# Altium schematic sheet Sheet1.SchDoc
size 449 x 400 mm; SheetNumber: 1; SheetTotal: 1
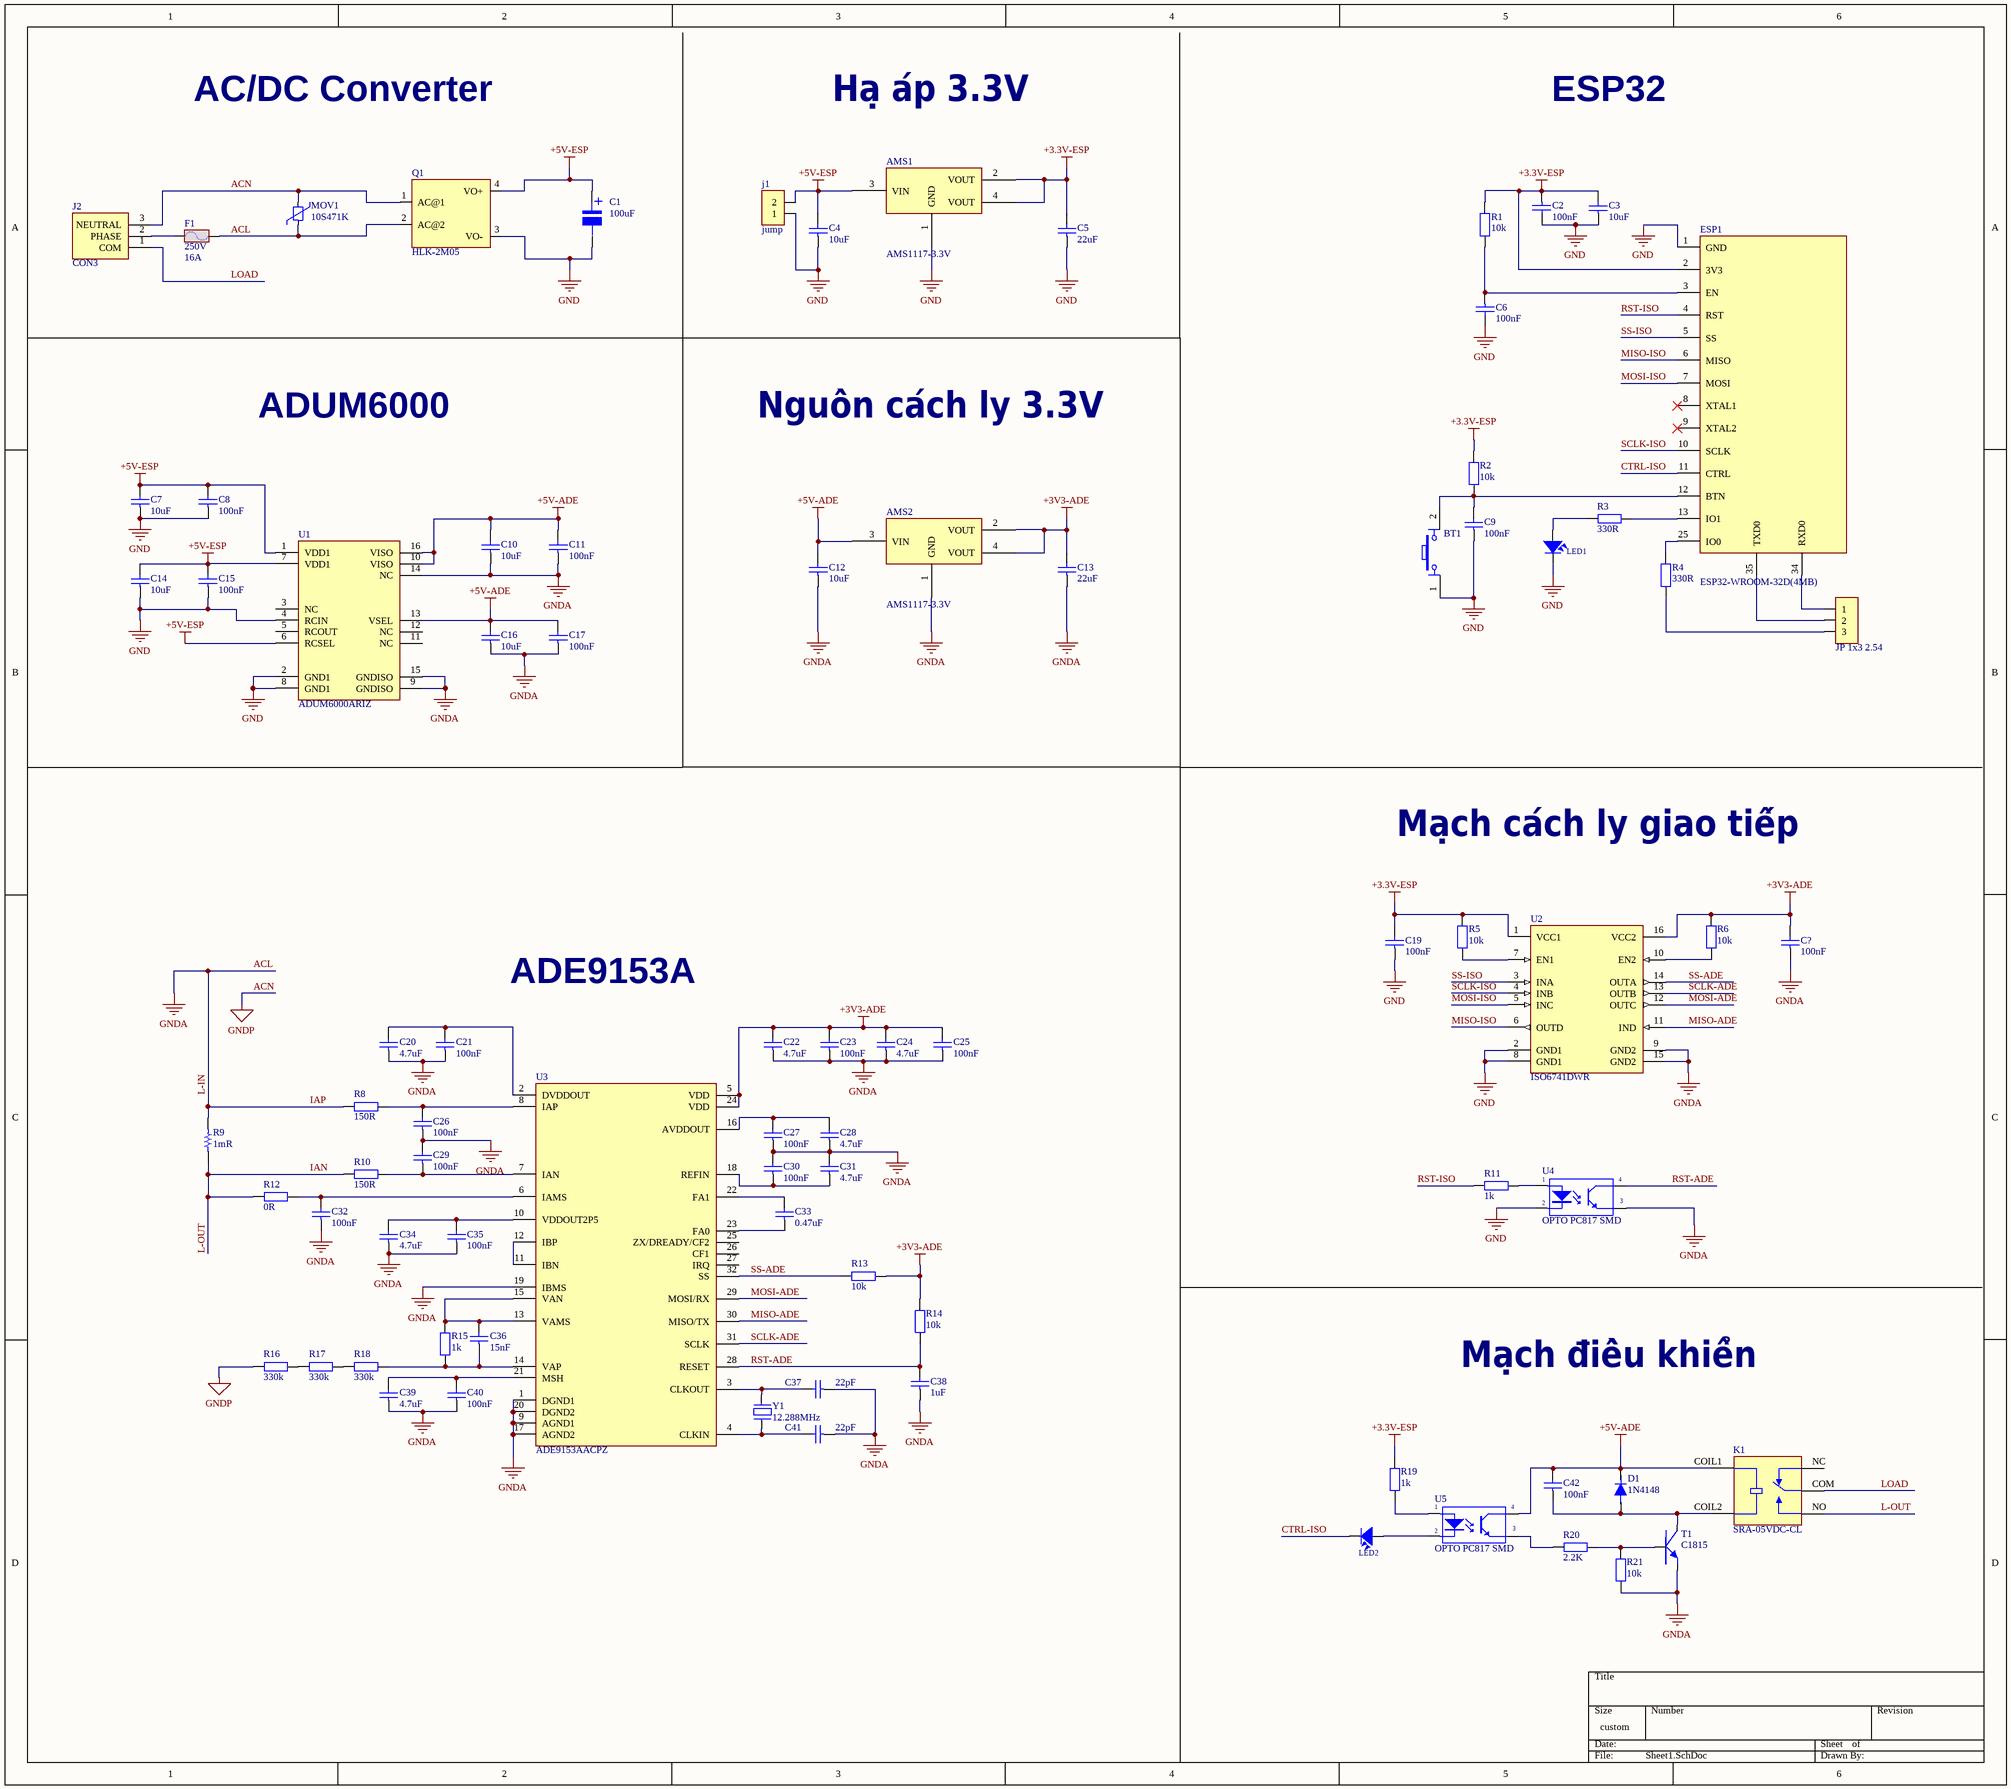
[diagram p0: Sheet1.SchDoc]

## Parts
AMS1  AMS1117-3.3V  [SOT223]
AMS2  AMS1117-3.3V  [SOT223]
BT1  Nut Nhan 4 Chan Cam 6x6  [Nut Nhan 4 Chan Cam 6x6]  (value not drawn)
C1  100uF  [tu nhom 6.3 (d)]
C2  100nF  [C0603C/1608MM]
C3  10uF  [C0603C/1608MM]
C4  10uF  [C0603C/1608MM]
C5  22uF  [C0603C/1608MM]
C6  100nF  [C0603C/1608MM]
C7  10uF  [C0603C/1608MM]
C8  100nF  [C0603C/1608MM]
C9  100nF  [C0603C/1608MM]
C10  10uF  [C0603C/1608MM]
C11  100nF  [C0603C/1608MM]
C12  10uF  [C0603C/1608MM]
C13  22uF  [C0603C/1608MM]
C14  10uF  [C0603C/1608MM]
C15  100nF  [C0603C/1608MM]
C16  10uF  [C0603C/1608MM]
C17  100nF  [C0603C/1608MM]
C19  100nF  [C0603C/1608MM]
C20  4.7uF  [C0603C/1608MM]
C21  100nF  [C0603C/1608MM]
C22  4.7uF  [C0603C/1608MM]
C23  100nF  [C0603C/1608MM]
C24  4.7uF  [C0603C/1608MM]
C25  100nF  [C0603C/1608MM]
C26  100nF  [C0603C/1608MM]
C27  100nF  [C0603C/1608MM]
C28  4.7uF  [C0603C/1608MM]
C29  100nF  [C0603C/1608MM]
C30  100nF  [C0603C/1608MM]
C31  4.7uF  [C0603C/1608MM]
C32  100nF  [C0603C/1608MM]
C33  0.47uF  [C0603C/1608MM]
C34  4.7uF  [C0603C/1608MM]
C35  100nF  [C0603C/1608MM]
C36  15nF  [C0603C/1608MM]
C37  22pF  [C0603C/1608MM]
C38  1uF  [C0603C/1608MM]
C39  4.7uF  [C0603C/1608MM]
C40  100nF  [C0603C/1608MM]
C41  22pF  [C0603C/1608MM]
C42  100nF  [C0603C/1608MM]
C?  100nF  [C0603C/1608MM]
D1  1N4148  [SOD-323]
ESP1  ESP32-WROOM-32D(4MB)  [ESP32]
F1  Voltage - Rated: 250V  Current Rating (Amps): 16A  [FUSE_VERTICAL]  (hidden comment: 5A220V)
j1  jump  [Jump 2]
J2  CON3  [CON3]
JP1  JP 1x3 2.54  [JP 1x3 DT]
K1  SRA-05VDC-CL  [RELAY_SRA-05VDC-CL]
LED1  LED SMD  [SM-LED-0805-Blue]  (value not drawn)
LED2  LED SMD  [SM-LED-0805-Blue]  (value not drawn)
MOV1  10S471K  [10S471K]
Q1  HLK-2M05  [HLK-2M05]
R1  10k  [tro smd 0603]
R2  10k  [tro smd 0603]
R3  330R  [tro smd 0603]
R4  330R  [tro smd 0603]
R5  10k  [tro smd 0603]
R6  10k  [tro smd 0603]
R8  150R  [tro smd 0603]
R9  1mR  [R2512B/6332MM]
R10  150R  [tro smd 0603]
R11  1k  [tro smd 0603]
R12  0R  [tro smd 0603]
R13  10k  [tro smd 0603]
R14  10k  [tro smd 0603]
R15  1k  [tro smd 0603]
R16  330k  [tro smd 0603]
R17  330k  [tro smd 0603]
R18  330k  [tro smd 0603]
R19  1k  [tro smd 0603]
R20  2.2K  [tro smd 0603]
R21  10k  [tro smd 0603]
T1  C1815  [C1815]
U1  ADUM6000ARIZ  [ADUM6000ARIZ]
U2  ISO6741DWR  [SOIC127P1030X265-16N]
U3  ADE9153AACPZ  [ADE9153]
U4  OPTO PC817 SMD  [SOP4]
U5  OPTO PC817 SMD  [SOP4]
Y1  12.288MHz  [Thach Anh 2 chan cam]

## Nets
+3.3V-ESP: AMS1.2(VOUT) AMS1.4(VOUT) C2.1 C3.2 C5.2 C19.2 ESP1.2(3V3) R1.2 R2.2 R5.2 R19.2 U2.1(VCC1)
+3V3-ADE: AMS2.2(VOUT) AMS2.4(VOUT) C13.2 C22.2 C23.2 C24.2 C25.2 C?.2 R6.2 R13.2 R14.2 U2.16(VCC2) U3.5(VDD) U3.24(VDD)
+5V-ADE: AMS2.3(VIN) C10.2 C11.2 C12.2 C16.2 C17.2 C42.2 D1.2(CATHODE) K1.COIL1 U1.10(VISO) U1.13(VSEL) U1.16(VISO) U5.4(C)
+5V-ESP: AMS1.3(VIN) C1.1 C4.2 C7.2 C8.2 C14.2 C15.2 j1.2 Q1.4(VO+) U1.1(VDD1) U1.6(RCSEL) U1.7(VDD1)
ACL: AMS2.1(GND) C10.1 C11.1 C12.1 C13.1 C16.1 C17.1 C20.1 C21.1 C22.1 C23.1 C24.1 C25.1 C26.1 C27.1 C28.1 C29.2 C30.2 C31.2 C32.1 C34.1 C35.1 C37.1 C38.1 C39.1 C40.1 C41.1 C?.1 F1.1 MOV1.2 Q1.2(AC@2) R8.1 R9.2 R21.1 T1.2 U1.9(GNDISO) U1.14(NC) U1.15(GNDISO) U2.9(GND2) U2.15(GND2) U3.1(DGND1) U3.9(AGND1) U3.17(AGND2) U3.19(IBMS) U3.20(DGND2) U4.3(E)  [also labelled GNDA, IAP, L-IN]
ACN: J2.3(NEUTRAL) MOV1.1 Q1.1(AC@1) R16.1  [also labelled GNDP]
GND: AMS1.1(GND) BT1.1 C1.2 C2.2 C3.1 C4.1 C5.1 C6.2 C7.1 C8.1 C9.1 C14.1 C15.1 C19.1 ESP1.1(GND) j1.1 LED1.2 Q1.3(VO-) U1.2(GND1) U1.4(RCIN) U1.8(GND1) U2.2(GND1) U2.8(GND1) U4.2(K)
CTRL-ISO: ESP1.11(CTRL) LED2.2
IAN: K1.NO R9.1 R10.1 R12.1  [also labelled L-OUT]
LOAD: J2.1(COM) K1.COM
MISO-ADE: U2.11(IND) U3.30(MISO/TX)
MISO-ISO: ESP1.6(MISO) U2.6(OUTD)
MOSI-ADE: U2.12(OUTC) U3.29(MOSI/RX)
MOSI-ISO: ESP1.7(MOSI) U2.5(INC)
RST-ADE: C38.2 R14.1 U3.28(RESET) U4.4(C)
RST-ISO: ESP1.4(RST) R11.1
SCLK-ADE: U2.13(OUTB) U3.31(SCLK)
SCLK-ISO: ESP1.10(SCLK) U2.4(INB)
SS-ADE: R13.1 U2.14(OUTA) U3.32(SS)
SS-ISO: ESP1.5(SS) U2.3(INA)
NetBT1_2: BT1.2 C9.2 ESP1.12(BTN) R2.1
NetC6_1: C6.1 ESP1.3(EN) R1.1
NetC20_2: C20.2 C21.2 U3.2(DVDDOUT)
NetC26_2: C26.2 R8.2 U3.8(IAP)
NetC27_2: C27.2 C28.2 U3.16(AVDDOUT)
NetC29_1: C29.1 R10.2 U3.7(IAN)
NetC30_1: C30.1 C31.1 U3.18(REFIN)
NetC32_2: C32.2 R12.2 U3.6(IAMS)
NetC33_1: C33.1 U3.23(FA0)
NetC33_2: C33.2 U3.22(FA1)
NetC34_2: C34.2 C35.2 U3.10(VDDOUT2P5)
NetC36_1: C36.1 R15.1 R18.2 U3.14(VAP)
NetC36_2: C36.2 R15.2 U3.13(VAMS) U3.15(VAN)
NetC37_2: C37.2 U3.3(CLKOUT) Y1.2
NetC39_2: C39.2 C40.2 U3.21(MSH)
NetC41_2: C41.2 U3.4(CLKIN) Y1.1
NetC42_1: C42.1 D1.1(ANODE) K1.COIL2 T1.3
NetESP1_13: ESP1.13(IO1) R3.1
NetESP1_25: ESP1.25(IO0) R4.1
NetESP1_34: ESP1.34(RXD0) JP1.1
NetESP1_35: ESP1.35(TXD0) JP1.2
NetF1_2: F1.2 J2.2(PHASE)
NetJP1_3: JP1.3 R4.2
NetLED1_1: LED1.1 R3.2
NetLED2_1: LED2.1 U5.2(K)
NetR5_1: R5.1 U2.7(EN1)
NetR6_1: R6.1 U2.10(EN2)
NetR11_2: R11.2 U4.1(A)
NetR16_2: R16.2 R17.1
NetR17_2: R17.2 R18.1
NetR19_1: R19.1 U5.1(A)
NetR20_1: R20.1 R21.2 T1.1
NetR20_2: R20.2 U5.3(E)
NetU3_11: U3.11(IBN) U3.12(IBP)

Not connected (* = marked no-connect by the designer): ESP1 8(XTAL1)* 9(XTAL2)*; K1 NC; U1 3(NC) 5(RCOUT) 11(NC) 12(NC); U3 25(ZX/DREADY/CF2) 26(CF1) 27(IRQ)

## Notes on the sheet
- AC/DC Converter
- Hạ áp 3.3V
- ESP32
- ADUM6000
- Nguồn cách ly 3.3V
- Mạch cách ly giao tiếp
- ADE9153A
- Mạch điều khiển
- (in symbol Tu Nhom 100uF 16V) +

## Library data of the parts
AMS1 AMS2 = AMS1117 SMD: Dán; Value: AMS1117-3.3V SOT223; Don_Vi: Con; Ma_Hang: MH000596; Ghi_Chu: *; Kieu_Chan: *; Chung_Loai: Dán
BT1 = Nut Nhan 4 Chan Cam 6x6: Nut Nhan 4 Chan 6x6mm; Ten: Nút Nhấn 4 Chân 6x6x5MM DIP; Ma_Hang: MH004584
C1 = Tu Nhom 100uF 16V: Dán; Don_Vi: Con; So_Chan: 2; Ten_Linh_Kien: Tụ Nhôm 100uF 16V 6.3x5.4MM; Ma_Hang: MH002219; Chung_Loai: Dán; Kieu_Chan: *
C2 C6 C8 C9 C11 C15 C17 C19 C21 C23 C25-C27 C29 C30 C32 C35 C40 C42 C? = CAP CER 100nF 16V 5% X7R 0603: Cap Ceramic 0.1uF 16V X7R 5% SMD 0603 125C T/R; Manufacturer: Yageo; Manufacturer Part Number: CC0603JRX7R7BB104; Supplier 1: Digi-Key; Stock 1: 333951; Pricing 1: 1=0.1, 10=0.077, 50=0.042, 100=0.0343, 500=0.02448, 1000=0.01923 (USD); Mount: Surface Mount; Case/Package: 0603; Number of Pins: 2; Case Code (Metric): 1608; Case Code (Imperial): 0603; Min Operating Temperature: -55°C; Max Operating Temperature: 125°C; Capacitance: 100nF; Tolerance: 5%; Voltage Rating: 16V; Packaging: Tape and Reel; Dielectric: X7R; Voltage Rating (DC): 16V; Series: CC; Length: 1.6mm; Width: 0.031inch; Thickness: 0.035inch; Depth: 0.8mm; Radiation Hardening: No; Lead Free: Lead Free; Halogen Free: Halogen Free; RoHS Compliant: Yes; ComponentLink1URL: https://www.verical.com/server-webapp/html/getDatasheet?partID=403543&src-supplier=Verical; ComponentLink1Description: https://www.verical.com/server-webapp/html/getDatasheet?partID=403543&src-supplier=Verical; Supplier Part Number 1: 311-1776-1-ND
C3-C5 C7 C10 C12-C14 C16 = CAP CER 10uF 16V X7R 0603: CAP CER 0603 10uF 16V X7R 10%
C20 C22 C24 C28 C31 C33 C34 C36-C39 C41 = CAP CER 100nF 16V 5% X7R 0603: Cap Ceramic 0.1uF 16V X7R 5% SMD 0603 125C T/R; Manufacturer: Yageo; Manufacturer Part Number: CC0603JRX7R7BB104; Capacitance: 100nF; Supplier 1: Digi-Key; Stock 1: 333951; Pricing 1: 1=0.1, 10=0.077, 50=0.042, 100=0.0343, 500=0.02448, 1000=0.01923 (USD); Mount: Surface Mount; Case/Package: 0603; Number of Pins: 2; Case Code (Metric): 1608; Case Code (Imperial): 0603; Min Operating Temperature: -55°C; Max Operating Temperature: 125°C; Tolerance: 5%; Voltage Rating: 16V; Packaging: Tape and Reel; Dielectric: X7R; Voltage Rating (DC): 16V; Series: CC; Length: 1.6mm; Width: 0.031inch; Thickness: 0.035inch; Depth: 0.8mm; Radiation Hardening: No; Lead Free: Lead Free; Halogen Free: Halogen Free; RoHS Compliant: Yes; ComponentLink1URL: https://www.verical.com/server-webapp/html/getDatasheet?partID=403543&src-supplier=Verical; ComponentLink1Description: https://www.verical.com/server-webapp/html/getDatasheet?partID=403543&src-supplier=Verical; Supplier Part Number 1: 311-1776-1-ND
D1 = DIODE GEN PURP 75V 150MA DO35
ESP1 = ESP32-WROOM-32D(4MB): Bluetooth and Wi-Fi Module 2.4GHz to 2.5GHz 2.7V to 3.6V 4MB Flash 38-Pin SMD Module; Manufacturer: Espressif Systems; Stock 1: 0; Supplier 1: Digi-Key; Supplier Part Number 1: 1965-ESP32-WROOM-32D(4MB)CT-ND; Manufacturer Part Number: ESP32-WROOM-32D(4MB)
F1 = Fuse: FUSE 220V 5A RADIAL; PROCESS_TYPE: MA; Unit: PCS; Response Time: 24S; Breaking Capacity @ Rated Voltage: 50A; DC Cold Resistance: 0.03 Ohms; Melting I²t: 0.919; CATEGORY: FUSE; Value: 5A220V; Package / Case: TH2
j1 = Jump 2
JP1 = JP 1x3 2.54 Duc Thang: Cắm; Ten_Linh_Kien: Jump Đơn Đực 2.54MM 1x40P Thẳng 11MM; Don_Vi: Con; Ma_Hang: MH000903; Ghi_Chu: *; Kieu_Chan: *; Chung_Loai: Cắm
K1 = SRA-05VDC-CL: MF: Songle Relay; SnapEDA_Link: https://www.snapeda.com/parts/SRA-05VDC-CL/Songle+Relay/view-part/?ref=snap; Package: Package; Value: *; MP: SRA-05VDC-CL; Check_prices: https://www.snapeda.com/parts/SRA-05VDC-CL/Songle+Relay/view-part/?ref=eda
LED1 LED2 = LED SMD 0805
MOV1 = MOV 10S471K: VARISTOR 470V 2.5KA DISC 10MM; MANUFACTURER2_PART#: 10D391K 390V 10mm; MANUFACTURER1: Bourns; MANUFACTURER1_PART#: MOV-10D391K; LOH_CODE: CLA1220; Value: 10D391; MANUFACTURER2: http://linhkienchatluong.vn/tu-chong-set---varistor/tu-chong-set-varistor-10d391k-390v-10mm_sp1161_ct1335.aspx; CATEGORY: VARISTOR
Q1 = HLK-2M05: 2W Subminiature Series Module Power Supply; MF: Hi-link; SnapEDA_Link: https://www.snapeda.com/parts/HLK-2M05/Hi-link/view-part/?ref=snap; Package: Package; Check_prices: https://www.snapeda.com/parts/HLK-2M05/Hi-link/view-part/?ref=eda; MP: HLK-2M05; Value: *; Availability: Not in stock; Price: None
R1-R6 R13 R14 = Tro 0603 1% 10k: Dán; Don_Vi: Con; So_Chan: 2; Ten_Linh_Kien: Trở 0603 1% 10k; Ma_Hang: MH006333; Chung_Loai: Dán; Kieu_Chan: *
R8 R10-R12 R15-R21 = Tro 0603 1% 1k: Dán; So_Chan: 2; Don_Vi: Con; Ten_Linh_Kien: Trở 0603 1% 1k; Ma_Hang: MH006334; Chung_Loai: Dán; Kieu_Chan: *
R9 = RES SMD 0.015 OHM 1% 1W 2512: Current Sense Resistors - SMD MSMA, 2512 SIZE, 1 Watt, 15 mohm, 50 TCR NiCu Metal AEC-Q; Manufacturer: Eaton; Manufacturer Part Number: MSMA2512R0150FCN; Supplier 1: Newark; RoHS: No; Category: Chip SMD Resistors; Stock 1: 3990; Pricing 1: 10=0.235, 25=0.221, 50=0.208, 100=0.195 (USD); Supplier Part Number 1: 61AK4371
U1 = ADUM6000ARIZ: ANALOG DEVICES         ADUM6000ARIZ            Digital Isolator, 1 Channel, 3 V, 5.5 V, SOIC, 16 Pins; Number of Outputs: 1; Output Current: 80mA; Min Input Voltage: 3V; Max Output Current: 100mA; Max Input Voltage: 5.5V; Efficiency: 31%; Voltage - Output 1: 5V; Isolation Voltage: 5kV; Max Output Power: 400mW; Switching Frequency: 180MHz; Output Type: Fixed; Nominal Supply Current: 290mA; Stock 1: 137; Case/Package: SOIC; Number of Pins: 16; Contact Plating: Tin,Matte; Min Operating Temperature: -40°C; Max Operating Temperature: 105°C; Packaging: Rail/Tube; Package Quantity: 37; Max Power Dissipation: 400mW; Features: UVLO,OCP,OTP; Series: IsoPower®, iCoupler®; Max Supply Voltage: 5.5V; Output Voltage: 5V; Min Supply Voltage: 3V; Number of Channels: 1; Max Output Voltage: 5V; Supply Current: 290mA; Length: 0.5inch; Width: 7.6mm; Height: 0.1inch; Radiation Hardening: No; Lead Free: Contains Lead; REACH SVHC: No SVHC; ComponentLink1URL: https://www.verical.com/server-webapp/html/getDatasheet?partID=350224&src-supplier=Verical; ComponentLink1Description: https://www.verical.com/server-webapp/html/getDatasheet?partID=350224&src-supplier=Verical; ComponentLink2URL: http://www.farnell.com/datasheets/1793817.pdf?src-supplier=Element14; ComponentLink2Description: http://www.farnell.com/datasheets/1793817.pdf?src-supplier=Element14; ComponentLink3URL: https://www.analog.com/media/en/technical-documentation/data-sheets/ADuM6000.PDF?src-supplier=Digi-Key; ComponentLink3Description: https://www.analog.com/media/en/technical-documentation/data-sheets/ADuM6000.PDF?src-supplier=Digi-Key; ComponentLink4URL: http://www.analog.com/static/imported-files/data_sheets/ADuM6000.PDF?src-supplier=Avnet; ComponentLink4Description: http://www.analog.com/static/imported-files/data_sheets/ADuM6000.PDF?src-supplier=Avnet; ComponentLink5URL: http://components.arrow.com/part/dataview/51362085S9098404N2771?src-supplier=Arrow+Electronics; ComponentLink5Description: http://components.arrow.com/part/dataview/51362085S9098404N2771?src-supplier=Arrow+Electronics; Supplier 1: Digi-Key; Supplier Part Number 1: ADUM6000ARIZ-ND; Manufacturer: Analog Devices; Manufacturer Part Number: ADUM6000ARIZ; Pricing 1: 1=9.42, 10=8.514, 25=8.118, 100=7.0488, 250=6.732, 500=6.138 (USD)
U2 = ISO6741DWR: General-purpose, quad-channel, 3/1 digital isolator; MF: Texas Instruments; SnapEDA_Link: https://www.snapeda.com/parts/ISO6741DWR/Texas+Instruments/view-part/?ref=snap; Package: None; Value: *; MP: ISO6741DWR; Check_prices: https://www.snapeda.com/parts/ISO6741DWR/Texas+Instruments/view-part/?ref=eda
U3 = ADE9153AACPZ: Energy Measurement 32-Pin LFCSP EP Tray; Manufacturer: Analog Devices; Operating Supply Current: 9.3mA; Stock 1: 733; Mount: Surface Mount; Number of Pins: 32; Min Operating Temperature: -40°C; Max Operating Temperature: 85°C; Packaging: Tray; ComponentLink1URL: https://www.analog.com/media/en/technical-documentation/data-sheets/ade9153a.pdf?src-supplier=Digi-Key; ComponentLink1Description: https://www.analog.com/media/en/technical-documentation/data-sheets/ade9153a.pdf?src-supplier=Digi-Key; Supplier 1: Digi-Key; Supplier Part Number 1: ADE9153AACPZ-ND; Manufacturer Part Number: ADE9153AACPZ; Pricing 1: 1=7, 10=6.321, 25=6.0272, 100=4.998, 250=4.557, 500=4.263, 1000=3.9102 (USD)
U4 U5 = OPTO PC817 SMD: Single Opto; Value: PC817
Y1 = Thach Anh 2 chan Cam: Crystal For all Crystal 2pin.; Value: 4Mhz